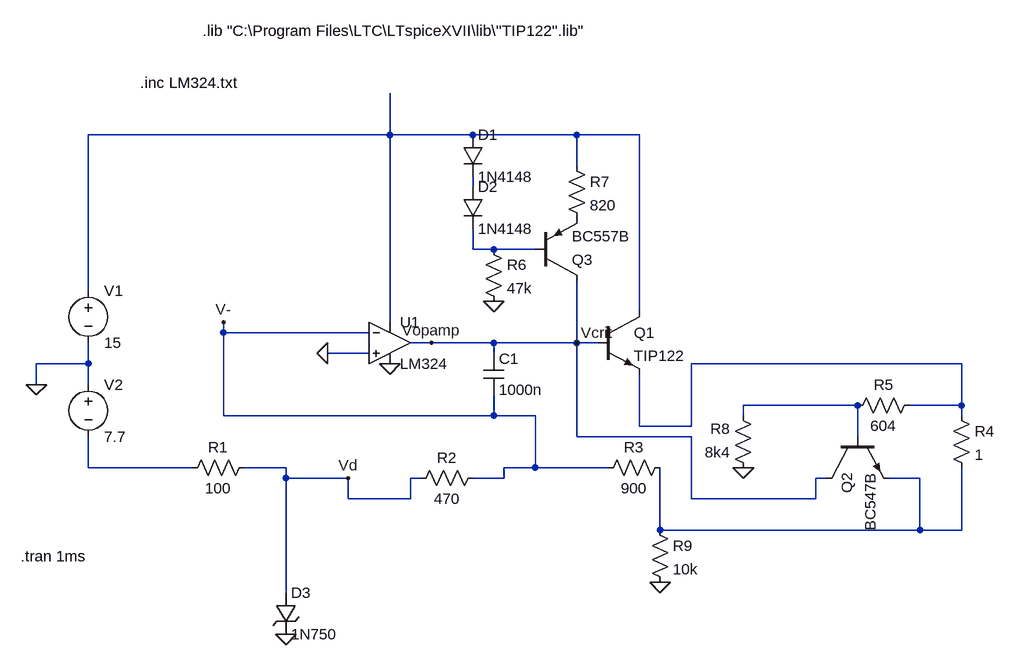
[diagram p0: schematic simGlazo.asc]
simGlazo.asc, the LTspice schematic file:
Version 4
SHEET 1 1332 752
WIRE 192 -208 192 -272
WIRE 192 -208 -272 -208
WIRE 320 -208 192 -208
WIRE 480 -208 320 -208
WIRE 576 -208 480 -208
WIRE 480 -160 480 -208
WIRE 320 -128 320 -144
WIRE 320 -32 320 -64
WIRE 352 -32 320 -32
WIRE 416 -32 352 -32
WIRE -272 32 -272 -208
WIRE 576 64 576 -208
WIRE 192 80 192 -208
WIRE -64 96 -64 80
WIRE 160 96 -64 96
WIRE 256 112 224 112
WIRE 352 112 256 112
WIRE 480 112 480 16
WIRE 480 112 352 112
WIRE 512 112 480 112
WIRE 160 128 96 128
WIRE 352 128 352 112
WIRE -272 144 -272 112
WIRE -272 144 -352 144
WIRE 1072 144 656 144
WIRE -352 176 -352 144
WIRE -272 176 -272 144
WIRE 912 208 736 208
WIRE 1072 208 1072 144
WIRE 1072 208 992 208
WIRE -64 224 -64 96
WIRE 352 224 352 192
WIRE 352 224 -64 224
WIRE 416 224 352 224
WIRE 736 224 736 208
WIRE 1072 224 1072 208
WIRE 576 240 576 160
WIRE 656 240 656 144
WIRE 656 240 576 240
WIRE 480 256 480 112
WIRE 656 256 480 256
WIRE 912 256 912 208
WIRE -272 304 -272 256
WIRE -112 304 -272 304
WIRE 32 304 -32 304
WIRE 416 304 416 224
WIRE 416 304 368 304
WIRE 528 304 416 304
WIRE 32 320 32 304
WIRE 128 320 32 320
WIRE 240 320 224 320
WIRE 368 320 368 304
WIRE 368 320 320 320
WIRE 864 320 848 320
WIRE 1008 320 960 320
WIRE 128 352 128 320
WIRE 224 352 224 320
WIRE 224 352 128 352
WIRE 656 352 656 256
WIRE 848 352 848 320
WIRE 848 352 656 352
WIRE 608 400 608 304
WIRE 1008 400 1008 320
WIRE 1008 400 608 400
WIRE 1072 400 1072 304
WIRE 1072 400 1008 400
WIRE 32 496 32 320
FLAG 192 144 0
FLAG -352 176 0
FLAG 352 48 0
FLAG -64 80 V-
FLAG 128 320 Vd
FLAG 480 112 Vcrit
FLAG 256 112 Vopamp
FLAG 736 304 0
FLAG 608 480 0
FLAG 96 128 0
FLAG 32 560 0
SYMBOL Opamps\\opamp2 192 48 R0
SYMATTR InstName U1
SYMATTR Value LM324
SYMBOL voltage -272 16 R0
SYMATTR InstName V1
SYMATTR Value 15
SYMBOL diode 304 -208 R0
SYMATTR InstName D1
SYMATTR Value 1N4148
SYMBOL diode 304 -128 R0
SYMATTR InstName D2
SYMATTR Value 1N4148
SYMBOL pnp 416 16 M180
SYMATTR InstName Q3
SYMATTR Value BC557B
SYMBOL res 464 -176 R0
SYMATTR InstName R7
SYMATTR Value 820
SYMBOL voltage -272 160 R0
SYMATTR InstName V2
SYMATTR Value 7.7
SYMBOL res -16 288 R90
WINDOW 0 0 56 VBottom 2
WINDOW 3 32 56 VTop 2
SYMATTR InstName R1
SYMATTR Value 100
SYMBOL res 336 304 R90
WINDOW 0 0 56 VBottom 2
WINDOW 3 32 56 VTop 2
SYMATTR InstName R2
SYMATTR Value 470
SYMBOL res 624 288 R90
WINDOW 0 0 56 VBottom 2
WINDOW 3 32 56 VTop 2
SYMATTR InstName R3
SYMATTR Value 900
SYMBOL res 336 -48 R0
SYMATTR InstName R6
SYMATTR Value 47k
SYMBOL npn 512 64 R0
SYMATTR InstName Q1
SYMATTR Value TIP122
SYMATTR Prefix X
SYMBOL res 1056 208 R0
SYMATTR InstName R4
SYMATTR Value 1
SYMBOL res 1008 192 R90
WINDOW 0 0 56 VBottom 2
WINDOW 3 32 56 VTop 2
SYMATTR InstName R5
SYMATTR Value 604
SYMBOL res 752 320 R180
WINDOW 0 36 76 Left 2
WINDOW 3 36 40 Left 2
SYMATTR InstName R8
SYMATTR Value 8k4
SYMBOL npn 864 256 M90
SYMATTR InstName Q2
SYMATTR Value BC547B
SYMBOL res 592 384 R0
SYMATTR InstName R9
SYMATTR Value 10k
SYMBOL zener 16 496 R0
SYMATTR InstName D3
SYMATTR Value 1N750
SYMBOL cap 336 128 R0
SYMATTR InstName C1
SYMATTR Value 1000n
TEXT -376 440 Left 2 !.tran 1ms
TEXT -192 -288 Left 2 !.inc LM324.txt
TEXT -96 -368 Left 2 !.lib "C:\\Program Files\\LTC\\LTspiceXVII\\lib\\''TIP122''.lib"

The netlist it stands for:
* simGlazo.asc
XU1 0 V- N001 0 Vopamp LM324  ; pins In+ In- V+ V- OUT
V1 N001 0 15
D1 N001 N002 1N4148
D2 N002 N003 1N4148
Q3 Vopamp N003 P001 0 BC557B
R7 N001 P001 820
V2 0 N006 7.7
R1 Vd N006 100
R2 V- Vd 470
R3 N007 V- 900
R6 N003 0 47k
XQ1 N001 Vopamp N004 TIP122  ; pins C B E
R4 N004 N007 1
R5 N004 N005 604
R8 0 N005 8k4
Q2 Vopamp N005 N007 0 BC547B
R9 N007 0 10k
D3 Vd 0 1N750
C1 Vopamp V- 1000n
.model D D
.lib standard.dio
.model NPN NPN
.model PNP PNP
.lib standard.bjt
.tran 1ms
.inc LM324.txt
.lib "C:\Program Files\LTC\LTspiceXVII\lib\''TIP122''.lib"
.backanno
.end